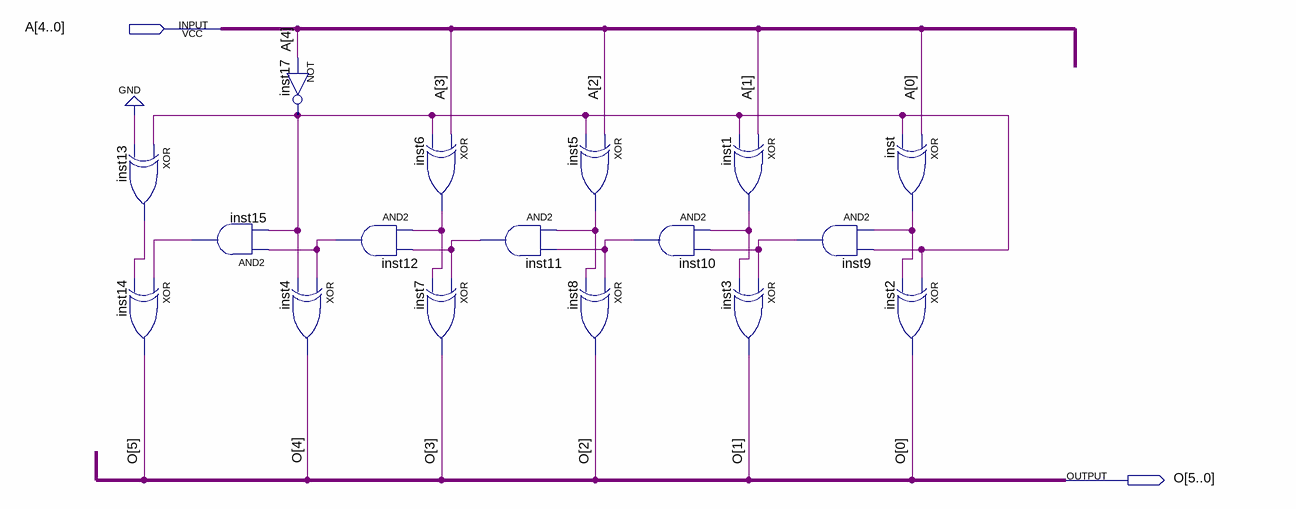
[diagram p0: schematic sheet]
// Quartus schematic C2_subtrador.bdf as structural Verilog: 17 symbols, 2 pins
module C2_subtrador (
  input  [4:0] A,
  output [5:0] O
);

  wire inst1_out, inst5_out, inst6_out, inst9_out, inst10_out, inst11_out, inst12_out, inst13_out,
       inst15_out, inst17_out, inst_out;

  xor inst13 (inst13_out, inst17_out, 1'b0);
  xor inst14 (O[5], inst15_out, inst13_out);
  and inst15 (inst15_out, inst12_out, inst17_out);
  not inst17 (inst17_out, A[4]);
  xor inst4 (O[4], inst12_out, inst17_out);
  and inst12 (inst12_out, inst6_out, inst11_out);
  xor inst6 (inst6_out, A[3], inst17_out);
  xor inst7 (O[3], inst11_out, inst6_out);
  and inst11 (inst11_out, inst5_out, inst10_out);
  xor inst5 (inst5_out, A[2], inst17_out);
  xor inst8 (O[2], inst10_out, inst5_out);
  and inst10 (inst10_out, inst1_out, inst9_out);
  xor inst1 (inst1_out, A[1], inst17_out);
  xor inst3 (O[1], inst9_out, inst1_out);
  and inst9 (inst9_out, inst_out, inst17_out);
  xor inst (inst_out, A[0], inst17_out);
  xor inst2 (O[0], inst17_out, inst_out);
endmodule
